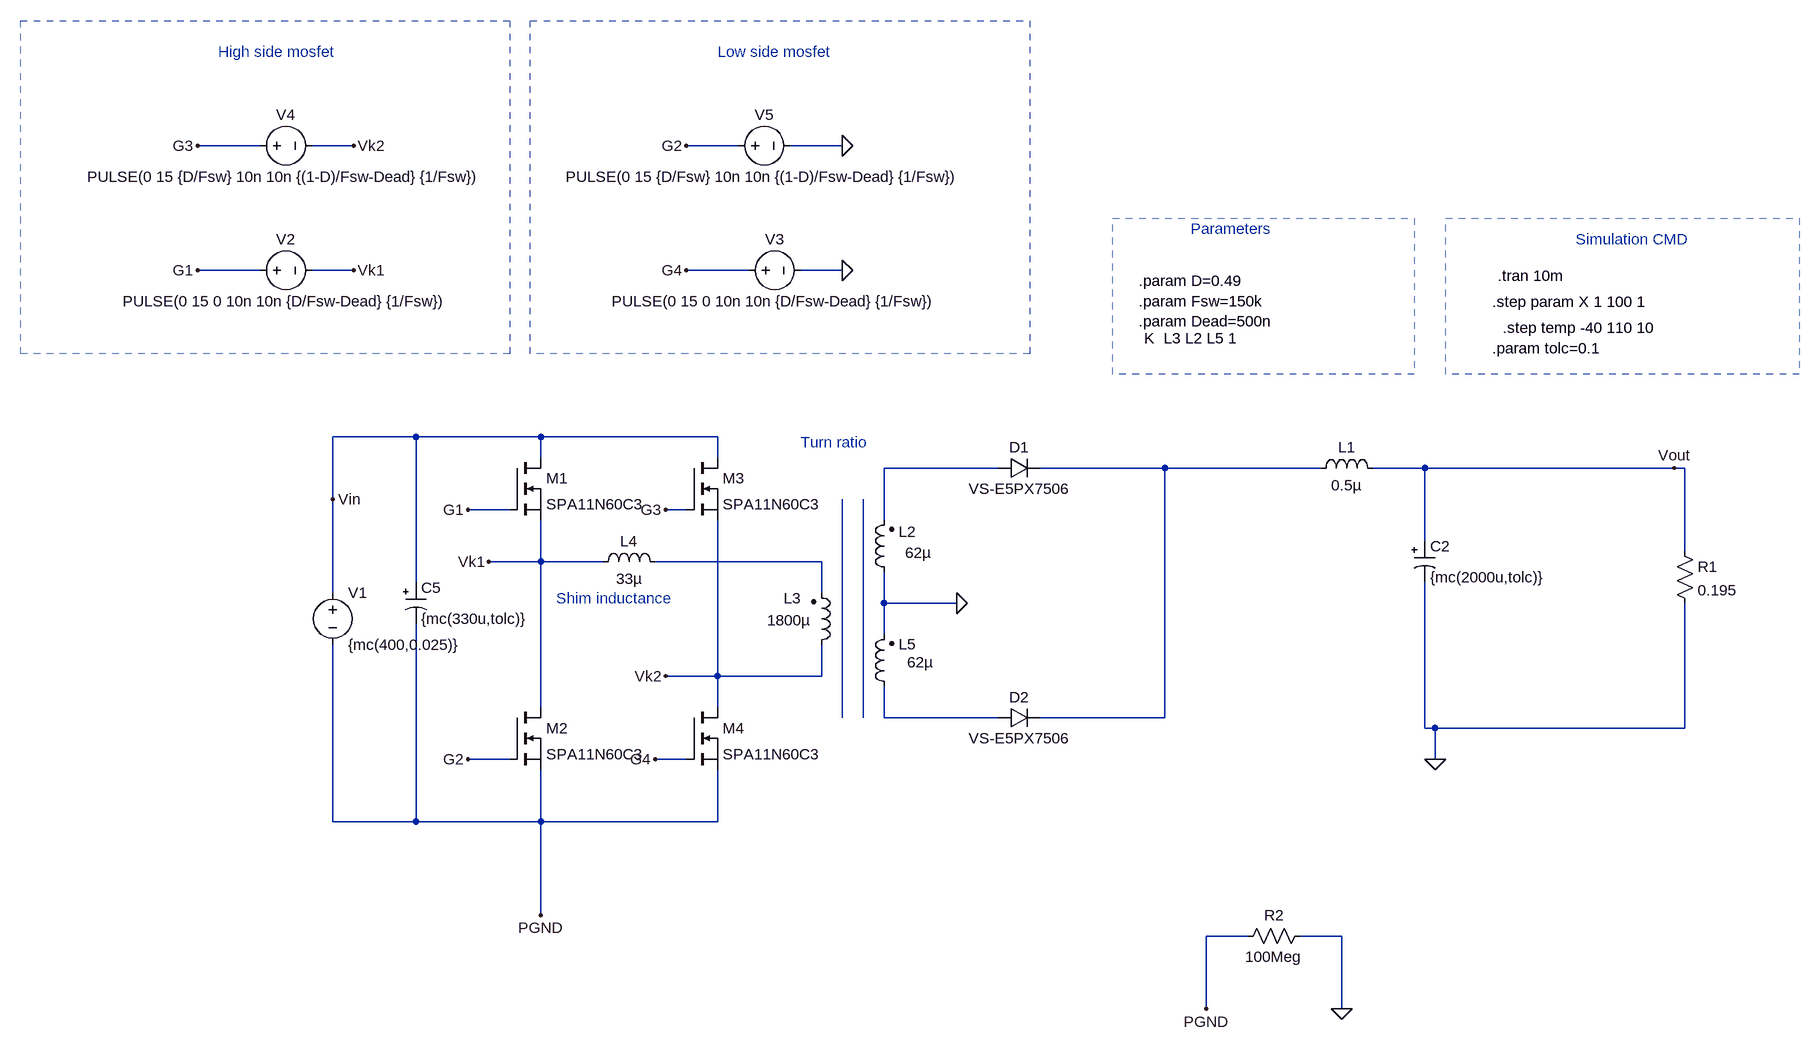
[diagram p0: schematic PSFBV5.asc]
PSFBV5.asc, the LTspice schematic file:
Version 4
SHEET 1 3016 1008
WIRE -304 -432 -400 -432
WIRE -160 -432 -224 -432
WIRE 432 -432 352 -432
WIRE 592 -432 512 -432
WIRE -304 -240 -400 -240
WIRE -160 -240 -224 -240
WIRE 448 -240 352 -240
WIRE 592 -240 528 -240
WIRE -64 16 -192 16
WIRE 128 16 -64 16
WIRE 400 16 128 16
WIRE 128 48 128 16
WIRE 400 48 400 16
WIRE 832 64 656 64
WIRE 1088 64 896 64
WIRE 1328 64 1088 64
WIRE 1488 64 1408 64
WIRE 1872 64 1488 64
WIRE 1888 64 1872 64
WIRE -192 112 -192 16
WIRE 80 128 16 128
WIRE 352 128 320 128
WIRE 656 144 656 64
WIRE 1488 176 1488 64
WIRE 1888 192 1888 64
WIRE 128 208 128 144
WIRE 128 208 48 208
WIRE 224 208 128 208
WIRE 560 208 304 208
WIRE -64 240 -64 16
WIRE -192 256 -192 112
WIRE 560 256 560 208
WIRE 656 272 656 224
WIRE 768 272 656 272
WIRE 656 320 656 272
WIRE 400 384 400 144
WIRE 400 384 320 384
WIRE 560 384 560 336
WIRE 560 384 400 384
WIRE 128 432 128 208
WIRE 400 432 400 384
WIRE 656 448 656 400
WIRE 832 448 656 448
WIRE 1088 448 1088 64
WIRE 1088 448 896 448
WIRE 1488 464 1488 240
WIRE 1504 464 1488 464
WIRE 1888 464 1888 272
WIRE 1888 464 1504 464
WIRE 80 512 16 512
WIRE 352 512 304 512
WIRE 1504 512 1504 464
WIRE -192 608 -192 336
WIRE -64 608 -64 304
WIRE -64 608 -192 608
WIRE 128 608 128 528
WIRE 128 608 -64 608
WIRE 400 608 400 528
WIRE 400 608 128 608
WIRE 128 752 128 608
WIRE 1216 784 1152 784
WIRE 1360 784 1296 784
WIRE 1152 896 1152 784
WIRE 1360 896 1360 784
FLAG 16 128 G1
FLAG 16 512 G2
FLAG 304 512 G4
FLAG 320 128 G3
FLAG -400 -240 G1
FLAG 48 208 Vk1
FLAG 320 384 Vk2
FLAG 592 -240 0
FLAG 352 -240 G4
FLAG -400 -432 G3
FLAG 592 -432 0
FLAG 352 -432 G2
FLAG -160 -432 Vk2
FLAG -160 -240 Vk1
FLAG 1872 64 Vout
FLAG 768 272 0
FLAG -192 112 Vin
FLAG 1504 512 0
FLAG 128 752 PGND
FLAG 1360 896 0
FLAG 1152 896 PGND
SYMBOL nmos 80 48 R0
SYMATTR InstName M1
SYMATTR Value SPA11N60C3
SYMBOL nmos 80 432 R0
SYMATTR InstName M2
SYMATTR Value SPA11N60C3
SYMBOL nmos 352 48 R0
SYMATTR InstName M3
SYMATTR Value SPA11N60C3
SYMBOL nmos 352 432 R0
SYMATTR InstName M4
SYMATTR Value SPA11N60C3
SYMBOL ind2 544 352 M180
WINDOW 0 -42 88 Left 2
WINDOW 3 -68 54 Left 2
SYMATTR InstName L3
SYMATTR Value 1800µ
SYMATTR Type ind
SYMBOL ind2 672 416 R180
WINDOW 0 -34 81 Left 2
WINDOW 3 -60 53 Left 2
SYMATTR InstName L5
SYMATTR Value 62µ
SYMATTR Type ind
SYMBOL voltage -192 240 R0
WINDOW 123 0 0 Left 0
WINDOW 39 24 124 Left 2
SYMATTR InstName V1
SYMATTR Value {mc(400,0.025)}
SYMBOL voltage -320 -240 R270
WINDOW 0 32 56 VTop 2
WINDOW 3 -32 56 VBottom 2
WINDOW 123 0 0 Left 0
WINDOW 39 0 0 Left 0
SYMATTR InstName V2
SYMATTR Value PULSE(0 15 0 10n 10n {D/Fsw-Dead} {1/Fsw})
SYMBOL voltage 432 -240 R270
WINDOW 0 32 56 VTop 2
WINDOW 3 -32 56 VBottom 2
WINDOW 123 0 0 Left 0
WINDOW 39 0 0 Left 0
SYMATTR InstName V3
SYMATTR Value PULSE(0 15 0 10n 10n {D/Fsw-Dead} {1/Fsw})
SYMBOL voltage -320 -432 R270
WINDOW 0 32 56 VTop 2
WINDOW 3 -32 56 VBottom 2
WINDOW 123 0 0 Left 0
WINDOW 39 0 0 Left 0
SYMATTR InstName V4
SYMATTR Value PULSE(0 15 {D/Fsw} 10n 10n {(1-D)/Fsw-Dead} {1/Fsw})
SYMBOL voltage 416 -432 R270
WINDOW 0 32 56 VTop 2
WINDOW 3 -32 56 VBottom 2
WINDOW 123 0 0 Left 0
WINDOW 39 0 0 Left 0
SYMATTR InstName V5
SYMATTR Value PULSE(0 15 {D/Fsw} 10n 10n {(1-D)/Fsw-Dead} {1/Fsw})
SYMBOL ind2 672 240 R180
WINDOW 0 -34 78 Left 2
WINDOW 3 -57 46 Left 2
SYMATTR InstName L2
SYMATTR Value 62µ
SYMATTR Type ind
SYMBOL ind 1312 80 R270
WINDOW 0 32 56 VTop 2
WINDOW 3 5 56 VBottom 2
SYMATTR InstName L1
SYMATTR Value 0.5µ
SYMATTR SpiceLine Ipk=100 Rser=0.00134 Rpar=534.23 Cpar=0 mfg="Coilcraft" pn="SER2011-501"
SYMBOL polcap 1472 176 R0
WINDOW 3 24 56 Left 2
SYMATTR Value {mc(2000u,tolc)}
SYMATTR InstName C2
SYMATTR Description Capacitor
SYMATTR Type cap
SYMATTR SpiceLine V=30
SYMBOL res 1312 768 R90
WINDOW 0 0 56 VBottom 2
WINDOW 3 32 56 VTop 2
SYMATTR InstName R2
SYMATTR Value 100Meg
SYMBOL polcap -80 240 R0
WINDOW 3 24 56 Left 2
SYMATTR Value {mc(330u,tolc)}
SYMATTR InstName C5
SYMATTR Description Capacitor
SYMATTR Type cap
SYMATTR SpiceLine V=450 Irms=2.29 Rser=0.104 Lser=9.09n
SYMBOL ind 208 224 R270
WINDOW 0 32 56 VTop 2
WINDOW 3 5 56 VBottom 2
SYMATTR InstName L4
SYMATTR Value 33µ
SYMATTR SpiceLine Ipk=20.2 Rser=0.0069 Rpar=5743 Cpar=14.457p mfg="Würth Elektronik" pn="74437529203330 WE-HCF 2920"
SYMBOL diode 832 80 R270
WINDOW 0 32 32 VTop 2
WINDOW 3 0 32 VBottom 2
SYMATTR InstName D1
SYMATTR Value VS-E5PX7506
SYMBOL diode 832 464 R270
WINDOW 0 32 32 VTop 2
WINDOW 3 0 32 VBottom 2
SYMATTR InstName D2
SYMATTR Value VS-E5PX7506
SYMBOL res 1872 176 R0
SYMATTR InstName R1
SYMATTR Value 0.195
TEXT 1600 -232 Left 2 !.tran 10m
TEXT 1056 -136 Left 2 !K  L3 L2 L5 1
TEXT 1048 -224 Left 2 !.param D=0.49\n.param Fsw=150k\n.param Dead=500n
TEXT -368 -576 Left 2 ;High side mosfet
TEXT 400 -576 Left 2 ;Low side mosfet
TEXT 1128 -304 Left 2 ;Parameters
TEXT 1720 -288 Left 2 ;Simulation CMD
TEXT 528 24 Left 2 ;Turn ratio
TEXT 152 264 Left 2 ;Shim inductance
TEXT 1592 -192 Left 2 !.step param X 1 100 1
TEXT 1608 -152 Left 2 !.step temp -40 110 10
TEXT 1592 -120 Left 2 !.param tolc=0.1
LINE Normal 624 448 624 112
LINE Normal 592 448 592 112
RECTANGLE Normal 1472 -80 1008 -320 2
RECTANGLE Normal 2064 -80 1520 -320 2
RECTANGLE Normal 80 -112 -672 -624 2
RECTANGLE Normal 880 -112 112 -624 2

The netlist it stands for:
* PSFBV5.asc
M1 Vin G1 Vk1 Vk1 SPA11N60C3
M2 Vk1 G2 PGND PGND SPA11N60C3
M3 Vin G3 Vk2 Vk2 SPA11N60C3
M4 Vk2 G4 PGND PGND SPA11N60C3
L3 Vk2 N003 1800µ
L5 N004 0 62µ
V1 Vin PGND {mc(400,0.025)}
V2 G1 Vk1 PULSE(0 15 0 10n 10n {D/Fsw-Dead} {1/Fsw})
V3 G4 0 PULSE(0 15 0 10n 10n {D/Fsw-Dead} {1/Fsw})
V4 G3 Vk2 PULSE(0 15 {D/Fsw} 10n 10n {(1-D)/Fsw-Dead} {1/Fsw})
V5 G2 0 PULSE(0 15 {D/Fsw} 10n 10n {(1-D)/Fsw-Dead} {1/Fsw})
L2 0 N001 62µ
L1 N002 Vout 0.5µ Ipk=100 Rser=0.00134 Rpar=534.23 Cpar=0 mfg="Coilcraft" pn="SER2011-501"
C2 Vout 0 {mc(2000u,tolc)} V=30
R2 0 PGND 100Meg
C5 Vin PGND {mc(330u,tolc)} V=450 Irms=2.29 Rser=0.104 Lser=9.09n
L4 Vk1 N003 33µ Ipk=20.2 Rser=0.0069 Rpar=5743 Cpar=14.457p mfg="Würth Elektronik" pn="74437529203330 WE-HCF 2920"
D1 N001 N002 VS-E5PX7506
D2 N004 N002 VS-E5PX7506
R1 Vout 0 0.195
.model D D
.lib standard.dio
.model NMOS NMOS
.model PMOS PMOS
.lib standard.mos
.tran 10m
K  L3 L2 L5 1
.param D=0.49
.param Fsw=150k
.param Dead=500n
* High side mosfet
* Low side mosfet
* Parameters
* Simulation CMD
* Turn ratio
* Shim inductance
.step param X 1 100 1
.step temp -40 110 10
.param tolc=0.1
.backanno
.end